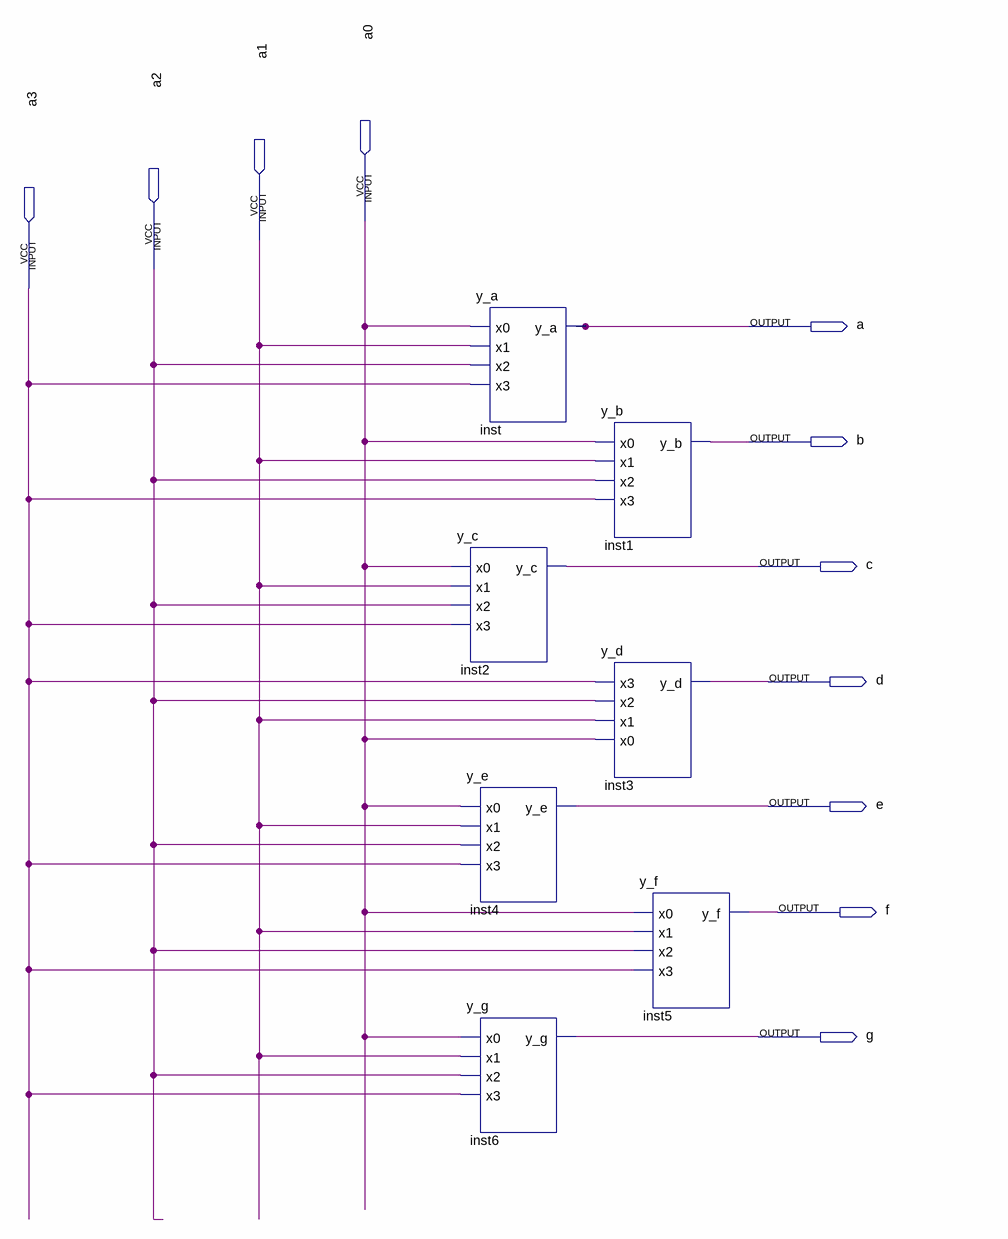
[diagram p0: schematic sheet]
// Quartus schematic BCD.bdf as structural Verilog: 7 symbols, 11 pins
module BCD (
  input  a0,
  input  a1,
  input  a2,
  input  a3,
  output a,
  output b,
  output c,
  output d,
  output e,
  output f,
  output g
);

  y_a inst (.x0(a0), .x1(a1), .x2(a2), .x3(a3), .y_a(a));
  y_c inst2 (.x0(a0), .x1(a1), .x2(a2), .x3(a3), .y_c(c));
  y_e inst4 (.x0(a0), .x1(a1), .x2(a2), .x3(a3), .y_e(e));
  y_g inst6 (.x0(a0), .x1(a1), .x2(a2), .x3(a3), .y_g(g));
  y_b inst1 (.x0(a0), .x1(a1), .x2(a2), .x3(a3), .y_b(b));
  y_d inst3 (.x3(a3), .x2(a2), .x1(a1), .x0(a0), .y_d(d));
  y_f inst5 (.x0(a0), .x1(a1), .x2(a2), .x3(a3), .y_f(f));
endmodule
